# Altium project PA107_PCB.PrjPcb
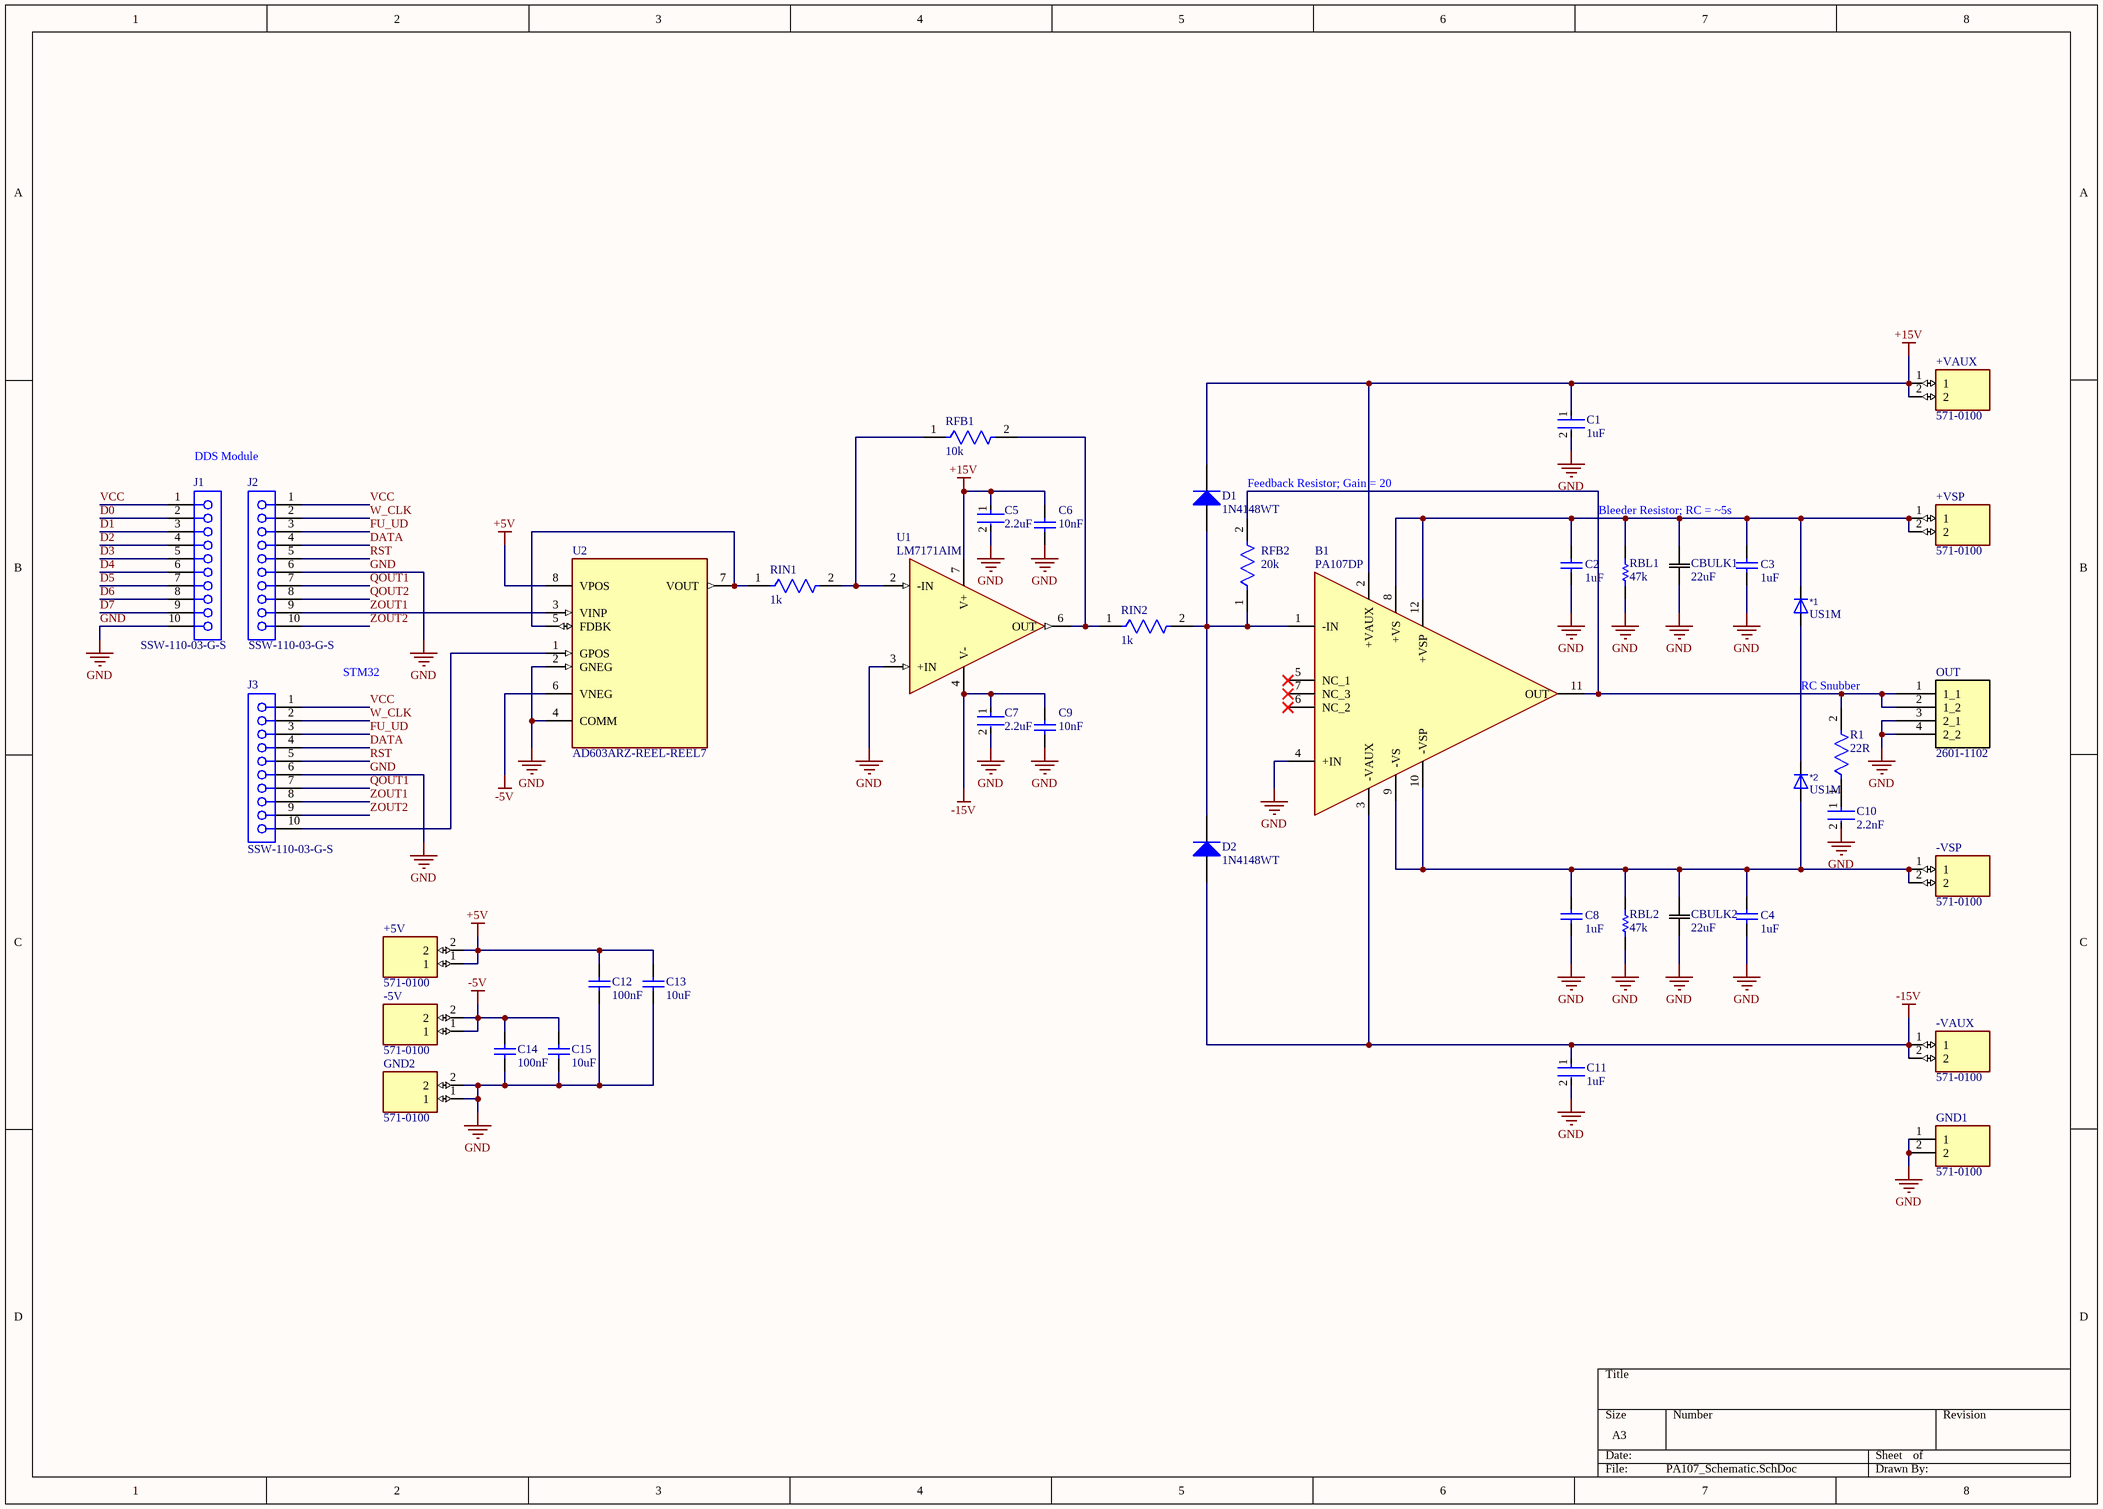
[diagram p0: PA107_Schematic.SchDoc]
1 sheet, 43 parts. Net scope: global (net labels, ports and power ports of the same name join across sheets).
Board file: PCB1.PcbDoc

## Sheet PA107_Schematic.SchDoc
size A3; SheetNumber: 1; SheetTotal: 1

### Parts
*1  US1M  [DO-214AC_SMA]
*2  US1M  [DO-214AC_SMA]
+5V  571-0100  [571-0100]
+VAUX  571-0100  [571-0100]
+VSP  571-0100  [571-0100]
-5V  571-0100  [571-0100]
-VAUX  571-0100  [571-0100]
-VSP  571-0100  [571-0100]
B1  PA107DP  [PA107DP]
C1  1uF  [FP-CC0805-0_85-MFG]
C2  1uF  [CAPC4532X279N]
C3  1uF  [CAPC4532X279N]
C4  1uF  [CAPC4532X279N]
C5  2.2uF  [FP-CC0805-0_85-MFG]
C6  10nF  [CAPC2013X145X48LL20T23]
C7  2.2uF  [FP-CC0805-0_85-MFG]
C8  1uF  [CAPC4532X279N]
C9  10nF  [CAPC2013X145X48LL20T23]
C10  2.2nF  [FP-HV1812-IPC_A]
C11  1uF  [FP-CC0805-0_85-MFG]
C12  100nF  [CAPC2013X145X48LL20T23]
C13  10uF  [CAPC2013X140X50ML20T25]
C14  100nF  [CAPC2013X145X48LL20T23]
C15  10uF  [CAPC2013X140X50ML20T25]
CBULK1  22uF  [CAP_BX_10x16_RUB]
CBULK2  22uF  [CAP_BX_10x16_RUB]
D1  1N4148WT  [FAIR-SOD-523F-2_V]
D2  1N4148WT  [FAIR-SOD-523F-2_V]
GND1  571-0100  [5710100]
GND2  571-0100  [571-0100]
J1  SSW-110-03-G-S  [SMTC-SSW-110-03-X-S]
J2  SSW-110-03-G-S  [SMTC-SSW-110-03-X-S]
J3  SSW-110-03-G-S  [SMTC-SSW-110-03-X-S]
OUT  2601-1102  [CONN2_2601-1102_WAG]
R1  22R  [FP-CRGP2512-IPC_C]
RBL1  47k  [RESC1210(3225)_L]
RBL2  47k  [RESC1210(3225)_L]
RFB1  10k  [FP-SR0805-MFG]
RFB2  20k  [FP-CRCW0805-HPe3-IPC_A]
RIN1  1k  [FP-CRCW0805-HPe3-IPC_B]
RIN2  1k  [FP-CRCW0805-HPe3-IPC_B]
U1  LM7171AIM  [SOIC127P599X175-8N]
U2  AD603ARZ-REEL-REEL7  [SOIC127P600X175-8N]

### Nets
+5V: +5V.1 +5V.2 C12.2 C13.2 U2.8(VPOS)
+15V: +VAUX.1 +VAUX.2 B1.2(+VAUX) C1.1 C5.1 C6.2 D1.1(K) U1.7(V+)
-5V: -5V.1 -5V.2 C14.2 C15.2 U2.6(VNEG)
-15V: -VAUX.1 -VAUX.2 B1.3(-VAUX) C7.1 C9.2 C11.1 D2.2(A) U1.4(V-)
GND: B1.4(+IN) C1.2 C2.1 C3.1 C4.1 C5.2 C6.1 C7.2 C8.1 C9.1 C10.2 C11.2 C12.1 C13.1 C14.1 C15.1 CBULK1.1 CBULK2.1 GND1.1 GND1.2 GND2.1 GND2.2 J1.10 J2.6 J3.6 OUT.3(2_1) OUT.4(2_2) RBL1.1 RBL2.1 U1.3(+IN) U2.2(GNEG) U2.4(COMM)
D0: J1.2
D1: J1.3
D2: J1.4
D3: J1.5
D4: J1.6
D5: J1.7
D6: J1.8
D7: J1.9
DATA: J2.4 J3.4
FU_UD: J2.3 J3.3
QOUT1: J2.7 J3.7
QOUT2: J2.8
RST: J2.5 J3.5
VCC: J1.1 J2.1 J3.1
W_CLK: J2.2 J3.2
ZOUT1: J2.9 J3.8 U2.3(VINP)
ZOUT2: J2.10 J3.9
Net*1_1: *1.1(K) +VSP.1 +VSP.2 B1.8(+VS) B1.12(+VSP) C2.2 C3.2 CBULK1.2 RBL1.2
Net*1_2: *1.2(A) *2.1(K)
Net*2_2: *2.2(A) -VSP.1 -VSP.2 B1.9(-VS) B1.10(-VSP) C4.2 C8.2 CBULK2.2 RBL2.2
NetB1_1: B1.1(-IN) D1.2(A) D2.1(K) RFB2.1 RIN2.2
NetB1_11: B1.11(OUT) OUT.1(1_1) OUT.2(1_2) R1.2 RFB2.2
NetC10_1: C10.1 R1.1
NetJ3_10: J3.10 U2.1(GPOS)
NetRFB1_1: RFB1.1 RIN1.2 U1.2(-IN)
NetRFB1_2: RFB1.2 RIN2.1 U1.6(OUT)
NetRIN1_1: RIN1.1 U2.5(FDBK) U2.7(VOUT)

Not connected (* = marked no-connect by the designer): B1 5(NC_1)* 6(NC_2)* 7(NC_3)*

### Notes on the sheet
- DDS Module
- Feedback Resistor; Gain = 20
- Bleeder Resistor; RC = ~5s
- STM32
- (near R1) RC Snubber

### Library data of the parts
*1 *2 = CMP-307-000068-2: Diode 1000 V 1A Surface Mount DO-214AC (SMA); Reference: D; Value: Diode; Datasheet: https://diotec.com/de/produktliste/D.html; Pin Count: 2; Design Item ID: Diode; ki_keywords: Diode; Source: diode.SchLib; Description_: Diode; Component Type: Standard
+5V +VAUX +VSP -5V -VAUX -VSP GND2 = CMP-416-000229-1: Connector Receptacle, Female Sockets Board Edge, Through Hole, Right Angle Black I-Trac; MF: Deltron; Pin Count: 2; MP: 571-0100; Source: 571-0100.SchLib; SnapEDA_Link: https://www.snapeda.com/parts/571-0100/Deltron/view-part/?ref=snap; Package: None; Design Item ID: 571-0100; Value: *; Component Type: Standard; Check_prices: https://www.snapeda.com/parts/571-0100/Deltron/view-part/?ref=eda
B1 = CMP-162-000000-3: PA107; Manufacturer_Name: Apex Microtechnology; Geometry.Height: 22.73mm; Design Item ID: PA107DP; Manufacturer_Part_Number: PA107DP; Source: PA107DP.SchLib; Datasheet Link: https://www.apexanalog.com/resources/products/pa107u.pdf; Arrow Price/Stock: *; Arrow Part Number: *; Mouser Part Number: 137-PA107DP; Mouser Price/Stock: https://www.mouser.co.uk/ProductDetail/Apex-Microtechnology/PA107DP?qs=TiOZkKH1s2QZuSYT1Lb%2FVw%3D%3D
C1 C11 = CMP-2100-03605-2: CAP CER 1UF 25V X7R 0805; Manufacturer Part Number: CC0805KKX7R8BB105; Manufacturer: Yageo; Material: Ceramic; Tolerance: 0.1; Capacitance: 1 uF; Temperature Characteristic: X7R; RoHS: TRUE; Value: 1 uF; Package: CC0805-0.85; Ipc Land Pattern Name: CAPC200125X85; Device Class L2: Capacitors; ComponentLink2URL: http://www.yageo.com/documents/recent/UPY-GPHC_Y5V_6.3V-to-50V_8.pdf; Height: 0.95mm; ComponentLink2Description: Datasheet; Voltage Rating: 25 V; Automotive: No; Device Class L1: Passive Components; Lead Free: Yes; Temperature Range Low: -30°C; Digikey Description: CAP CER 1UF 25V X7R 0805; Temperature: -30°C to +85°C; Temperature Range High: +85°C; Category: Cap; Device Class L3: Ceramic Capacitors; Footprint Url: http://www.yageo.com/exep/pages/download/literatures/UPY-C_GEN_24.pdf; Octopart: https://octopart.com/cc0805kkx7r8bb105-yageo-42244645; Mouser Description: Multilayer Ceramic Capacitor, CC Series, 1 - F, - 10%, X7R, 25 V, 0805 [2012 Metric]
C2-C4 C8 = CMP-292-000450-2: 1 ÂµF Â±10% 200V Ceramic Capacitor X7R 1812 (4532 Metric); MF: AVX; MP: 18122C105KAT2A; SnapEDA_Link: https://www.snapeda.com/parts/18122C105KAT2A/AVX/view-part/?ref=snap; Source: 18122C105KAT2A.SchLib; Value: *; Check_prices: https://www.snapeda.com/parts/18122C105KAT2A/AVX/view-part/?ref=eda; Design Item ID: 18122C105KAT2A; Component Type: Standard; Pin Count: 2; Package: 4532 AVX
C5 C7 = CMP-03422-001390-1: CAP CER 2.2UF 50V X7R 0805; Manufacturer: Yageo; Manufacturer Part Number: CC0805KKX7R9BB225; Tolerance: 0.1; Material: Ceramic; ComponentLink2Description: Datasheet; ComponentLink2URL: http://www.yageo.com/documents/recent/UPY-GPHC_Y5V_6.3V-to-50V_8.pdf; Voltage Rating: 50 V; Device Class L2: Capacitors; Footprint Url: http://www.yageo.com/exep/pages/download/literatures/UPY-C_GEN_24.pdf; Device Class L3: Ceramic Capacitors; Temperature Range High: +85°C; Category: Cap; Lead Free: Yes; Height: 0.95mm; Automotive: No; Value: 2.2 uF; Temperature Range Low: -30°C; Octopart: https://octopart.com/cc0805kkx7r9bb225-yageo-51849248; Temperature Characteristic: X7R; Ipc Land Pattern Name: CAPC200125X85; Mouser Description: 0805 50 V 2.2 uF ±10% Tolerance X7R Multilayer Ceramic Capacitor; RoHS: TRUE; Temperature: -30°C to +85°C; Capacitance: 2.2 uF; Package: CC0805-0.85; Digikey Description: CAP CER 2.2UF 50V X7R 0805; Device Class L1: Passive Components
C6 C9 = CMP-2007-03159-1: 10000 pF ±10% 50V Ceramic Capacitor X7R 0805 (2012 Metric); Manufacturer: Vitramon; Part Number: VJ0805Y103KXAMP
C10 = CMP-00030-71705866-1: HV1812Y222KXHATHV Multilayer Ceramic Capacitor, 2200 pF, 3000 V, ± 10%, X7R, 1812 [4532 Metric]; Voltage Rating: 3kV; RoHS: Compliant; NexarPartId: 71705866; Dielectric: X7R; Packaging: Cut Tape; REACH SVHC: No SVHC; Case Code (Imperial): 1812; Capacitance: 2.2nF; Length: 4.4958mm; Width: 3.2004mm; Mount: Surface Mount; Thickness: 2.6924mm; Schedule B: 8532240020, 8532240020; Case Code (Metric): 4532; Tolerance: 10%; Min Operating Temperature: -55°C; Voltage Rating (DC): 3kV; Case/Package: 1812; Max Operating Temperature: 125°C
C12 C14 = CMP-2007-01796-1: Part Number: VJ0805Y104MXAMT; Manufacturer: Vitramon
C13 C15 = CMP-2007-04702-1: Manufacturer: AVX Interconnect / Elco; Part Number: 0805ZC106KAT2A
CBULK1 CBULK2 = CMP-292-000454-1: No Description Available; Manufacturer_Name: Rubycon; Copyright: Copyright (C) 2026 Ultra Librarian. All rights reserved.; Design Item ID: 250BXC22MEFCT810X16; Source: 250BXC22MEFCT810X16.SchLib; Manufacturer_Part_Number: 250BXC22MEFCT810X16
D1 D2 = CMP-0881-00001-1: High Conductance Fast Switching Diode, 75 V, -55 to 150 degC, 2-Pin SOD523F, RoHS; Manufacturer: Fairchild Semiconductor; IR (VR: 75 V)=5 uA Max.; VF: 1 V Max.; BVR (IR: 5 uA)=75 V Min.; CO: 4 pF Max.; DatasheetVersion: Rev. A2; ComponentLink1Description: Manufacturer URL; PackageDescription: 2-Pin Surface Mount Device, Body 1.2 x 0.8 mm, Height 0.7 mm; ComponentLink2URL: http://www.fairchildsemi.com/ds/1N/1N4148WT.pdf; ComponentLink2Description: Datasheet; PartNumber: 1N4148WT; ComponentLink1URL: http://www.fairchildsemi.com/; Temperature Range: -55 to 150 degC; Mounting Technology: Surface Mount; PackageReference: SOD-523F-2; RoHS: TRUE
GND1 = CMP-165-000000-1: Test Sockets SINGLE PCB SOCK BLK; Manufacturer_Name: DELTRON COMPONENTS; Geometry.Height: 12.4mm; Datasheet Link: https://www.dem-uk.com/deltron-components/Data/Product_Downloads/deltron-571-0100-4mm-90deg-single-socket-data.pdf; Mouser Price/Stock: https://www.mouser.co.uk/ProductDetail/Deltron/571-0100?qs=E2gf03EXmtoqC8%2FBhoPdrg%3D%3D; Manufacturer_Part_Number: 571-0100; Mouser Part Number: 164-6218; Source: 571-0100.SchLib; Design Item ID: 571-0100
J1-J3 = CMP-1023-00394-1: SQ Post Socket, Through-hole, Vertical, -55 to 125 degC, 2.54 mm Pitch, 10-Pin, Female, RoHS; Manufacturer: Samtec; Pitch: 2.54 mm; PartNumber: SSW-110-03-G-S; ComponentLink2Description: Datasheet; ComponentLink3URL: http://www.samtec.com/documents/webfiles/cpdf/SSW-1XX-XX-XXX-X-XX-XXX-XX-MKT.pdf; ComponentLink1URL: http://www.samtec.com; RoHS: True; ComponentLink1Description: Manufacturer URL; ComponentLink2URL: http://www.samtec.com/documents/webfiles/pdf/SSW_TH.PDF; Temperature Range: -55 to 125 degC; PackageDescription: Assembly, Socket Strip .016 X .031 Tail; ComponentLink3Description: Package Specification; PackageReference: SSW-110-03-X-S; Orientation: Vertical; DatasheetVersion: F-214; PackageVersion: CA, 6/1987; Mounting Technology: Through-hole
OUT = CMP-1234-000000-4: Description; Manufacturer_Name: Wago; Design Item ID: 2601-1102; Type: Type; Manufacturer_Part_Number: 2601-1102; Source: 2601-1102.SchLib; Copyright: Copyright (C) 2026 Ultra Librarian. All rights reserved.; RefDes: RefDes
R1 = CMP-03211-002108-1: CRGP2512 22Ω 2W ±100ppm/°C 1% 500V; Manufacturer Part Number: CRGP2512F22R; Manufacturer: TE; Tolerance: 0.01; Temperature Coefficient: ±100ppm/°C; Temperature Range Low: -55°C; Power Rating: 2W; Category: Res; Package: CRGP2512; Device Class L1: Passive Components; ComponentLink2Description: Datasheet; Composition: Thick Film; Voltage Rating: 500V; Series: CRGP; Temperature: -55°C to +155°C; RoHS: TRUE; Ambient Temperature Range High: +70°C; Automotive: No; Device Class L3: Chip SMD Resistors; Height: 0.65mm; ComponentLink2URL: https://www.mouser.ca/datasheet/2/418/NG_DS_9-1773463-9_A-1358566.pdf; Octopart: https://octopart.com/crgp2512f22r-te+connectivity-91019048; Temperature Range High: +155°C; Resistance: 22Ω; Lead Free: Yes; Ipc Land Pattern Name: RESC635320X55; Value: 22Ω; Device Class L2: Resistors
RBL1 RBL2 = CMP-1015-00114-1: 47K 0.5W 5% 1210 (3225 Metric)  SMD; Case-EIA: 1210; Case-Metric: 3225; Value: 47000.00 Ohm; Technology: SMT; Power: 0.5 W; Tolerance: 5 %
RFB1 = CMP-03412-005404-1: RES SMD 0805 1/2W 1% 10K OHM; Manufacturer Part Number: SR0805FR-4710KL; Manufacturer: Yageo; Value: 10KΩ; Power Rating: 0.5W; Voltage Rating: 150V; Description: SR0805 10KΩ 0.5W 1.00%; Tolerance: 0.01; Automotive Grade: Grade 0; RoHS: TRUE; Package: SR0805; Temperature: -55°C to +155°C; Composition: Thick Film; Lead Free: Yes; Ipc Land Pattern Name: RESC200125X50; Footprint Url: http://www.yageo.com/exep/pages/download/literatures/PYu-R_Mount_10.pdf; ComponentLink2URL: http://www.yageo.com/documents/recent/PYu-SR_D_F%20tol_RoHS_L_3.pdf; Series: SR; Resistance: 10KΩ; Device Class L3: Chip SMD Resistors; Device Class L2: Resistors; Digikey Description: RES SMD 0805 1/2W 1% 10K OHM; Category: Res; Temperature Range Low: -55°C; ComponentLink2Description: Datasheet; Automotive: Yes; Height: 0.6mm; Octopart: https://octopart.com/sr0805fr-4710kl-yageo-91478094; Device Class L1: Passive Components; Temperature Range High: +155°C
RFB2 = CMP-02407-003063-1: RES Thick Film, 20kΩ, 1%, 0.5W, 100ppm/°C, 0805; Power Rating: 500mW; Voltage Rating: 150V; Resistance: 20kR; Max Power Dissipation: 333mW; Case Code (Imperial): 0805; Packaging: Tape and Reel; Lead Free: Lead Free; Case Code (Metric): 2012; Termination: SMD/SMT; Contact Plating: Tin; Depth: 1.25mm; Mount: Surface Mount; Height: 0.024inch; Min Operating Temperature: -55°C; Features: Automotive AEC-Q200; Case/Package: 0805; Length: 2mm; Temperature Coefficient: 100ppm/°C; Radiation Hardening: No; Width: 1.2mm; Weight: 0.000194oz; Package Quantity: 10; Max Operating Temperature: 155°C; Tolerance: 1%; Number of Terminations: 2; Composition: Thick Film
RIN1 RIN2 = CMP-02407-008945-1: RES Thick Film, 1kΩ, 5%, 0.5W, 200ppm/°C, 0805; Power Rating: 500mW; Voltage Rating: 150V; Max Power Dissipation: 333mW; Resistance: 1kR; Temperature Coefficient: 200ppm/°C; Min Operating Temperature: -55°C; Max Operating Temperature: 155°C; Weight: 0.000194oz; Case Code (Imperial): 0805; Case Code (Metric): 2012; Lead Free: Lead Free; Packaging: Tape and Reel; Number of Terminations: 2; Composition: Thick Film; Termination: SMD/SMT; Contact Plating: Tin; Features: Automotive AEC-Q200; Package Quantity: 1; Case/Package: 0805; Tolerance: 5%; Height: 0.024inch; Width: 0.049inch; Radiation Hardening: No; Length: 0.079inch
U1 = CMP-399-000036-4: Very High Speed, High Output Current, Voltage Feedback Amplifier; MF: Texas Instruments; MP: LM7171AIMX/NOPB; Package: SOIC-8 Texas Instruments; Pin Count: 5; SnapEDA_Link: https://www.snapeda.com/parts/LM7171AIMX/NOPB/Texas+Instruments/view-part/?ref=snap; Source: LM7171AIM.SchLib; Design Item ID: LM7171AIM; Component Type: Standard; Check_prices: https://www.snapeda.com/parts/LM7171AIMX/NOPB/Texas+Instruments/view-part/?ref=eda; Value: *
U2 = CMP-399-000037-2: Low Noise, 90 MHz Variable Gain Amplifier; MF: Analog Devices; MP: AD603ARZ-REEL7; Design Item ID: AD603ARZ-REEL-REEL7; SnapEDA_Link: https://www.snapeda.com/parts/AD603ARZ-REEL7/Analog+Devices/view-part/?ref=snap; Package: SOIC-8 Analog Devices; Value: *; Component Type: Standard; Check_prices: https://www.snapeda.com/parts/AD603ARZ-REEL7/Analog+Devices/view-part/?ref=eda; Pin Count: 8; Source: AD603ARZ-REEL-REEL7.SchLib